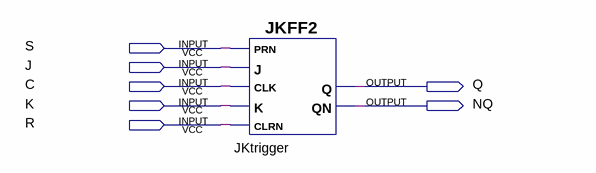
[diagram p0: schematic sheet]
// Quartus schematic test.bdf as structural Verilog: 1 symbols, 7 pins
module test (
  input  S,
  input  J,
  input  C,
  input  K,
  input  R,
  output Q,
  output NQ
);

  JKFF2 JKtrigger (.K(K), .CLRN(R), .CLK(C), .PRN(S), .J(J), .QN(NQ), .Q(Q));
endmodule
